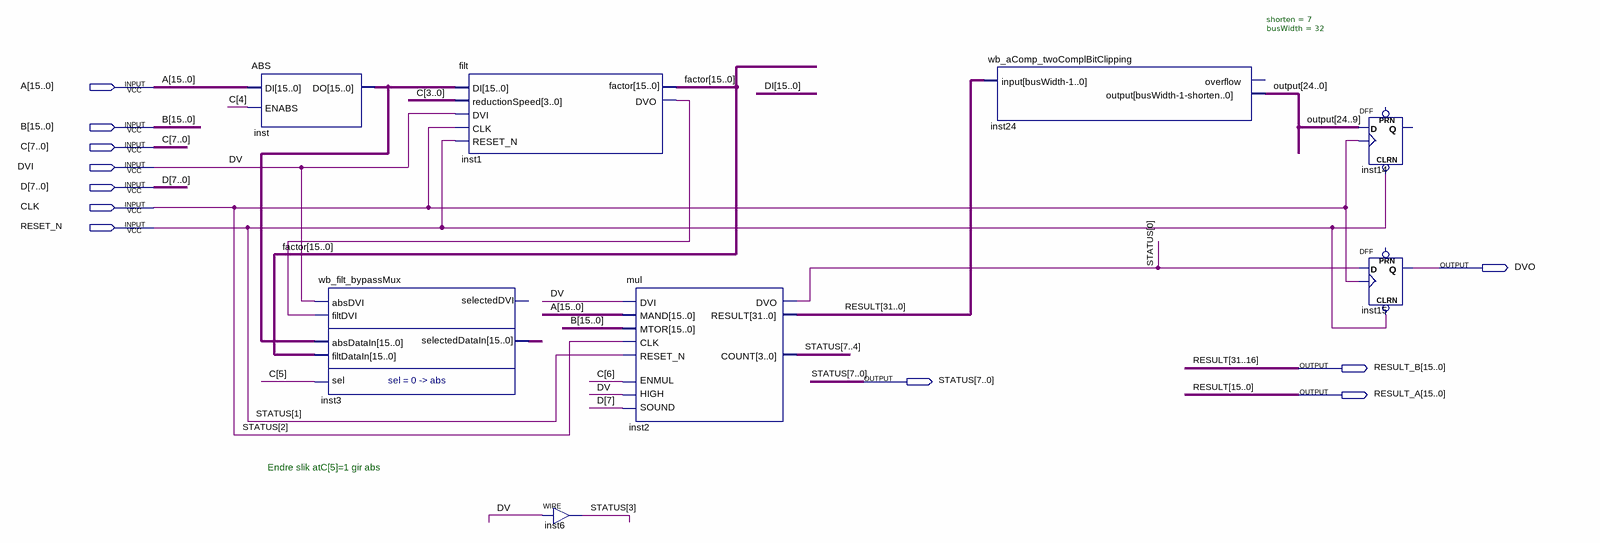
[diagram p0: schematic sheet]
// Quartus schematic StudentDesign_test.bdf as structural Verilog: 8 symbols, 11 pins
module StudentDesign_test (
  input  [15:0] A,
  input  [15:0] B,
  input  [7:0] C,
  input  DVI,
  input  [7:0] D,
  input  CLK,
  input  RESET_N,
  output DVO,
  output [15:0] RESULT_B,
  output [7:0] STATUS,
  output [15:0] RESULT_A
);

  wire inst1_dvo;
  wire [15:0] factor, inst3_selecteddatain, inst_do;
  wire [24:0] \output ;

  ABS inst (.ENABS(C[4]), .DI(A), .DO(inst_do));
  wb_filt_bypassMux inst3 (
    .sel(C[5]), .absDVI(DVI), .filtDVI(inst1_dvo), .absDataIn(inst_do), .filtDataIn(factor),
    .selectedDataIn(inst3_selecteddatain));  // open: selectedDVI
  filt inst1 (
    .reductionSpeed(C[3:0]), .DI(inst_do), .DVI(DVI), .CLK(CLK), .RESET_N(RESET_N), .DVO(inst1_dvo),
    .factor(factor));
  assign STATUS[3] = DVI;  // WIRE inst6
  mul inst2 (
    .DVI(DVI), .MAND(A), .MTOR(B), .RESET_N(RESET_N), .CLK(CLK), .ENMUL(C[6]), .HIGH(DVI), .SOUND(D[7]),
    .DVO(STATUS[0]), .COUNT(STATUS[7:4]), .RESULT({RESULT_B, RESULT_A}));
  wb_aComp_twoComplBitClipping #(.shorten(7), .busWidth(32)) inst24 (
    .\input ({RESULT_B, RESULT_A}), .\output (\output ));  // open: overflow
  DFF inst14[15:0] (.CLRN(RESET_N), .CLK(CLK), .D(\output [24:9]));  // open: PRN, Q
  DFF inst15 (.CLRN(RESET_N), .CLK(CLK), .D(STATUS[0]), .Q(DVO));  // open: PRN

  assign STATUS[2:1] = {CLK, RESET_N};

  // Other names for the same wires on the sheet: DV = DVI; RESULT[31:0] = {RESULT_B, RESULT_A}

  // Notes on the sheet:
  //   Endre slik atC[5]=1 gir abs
endmodule
